# Altium schematic sheet 5Vsupply.SchDoc
size A4; SheetNumber: 2; SheetTotal: 3
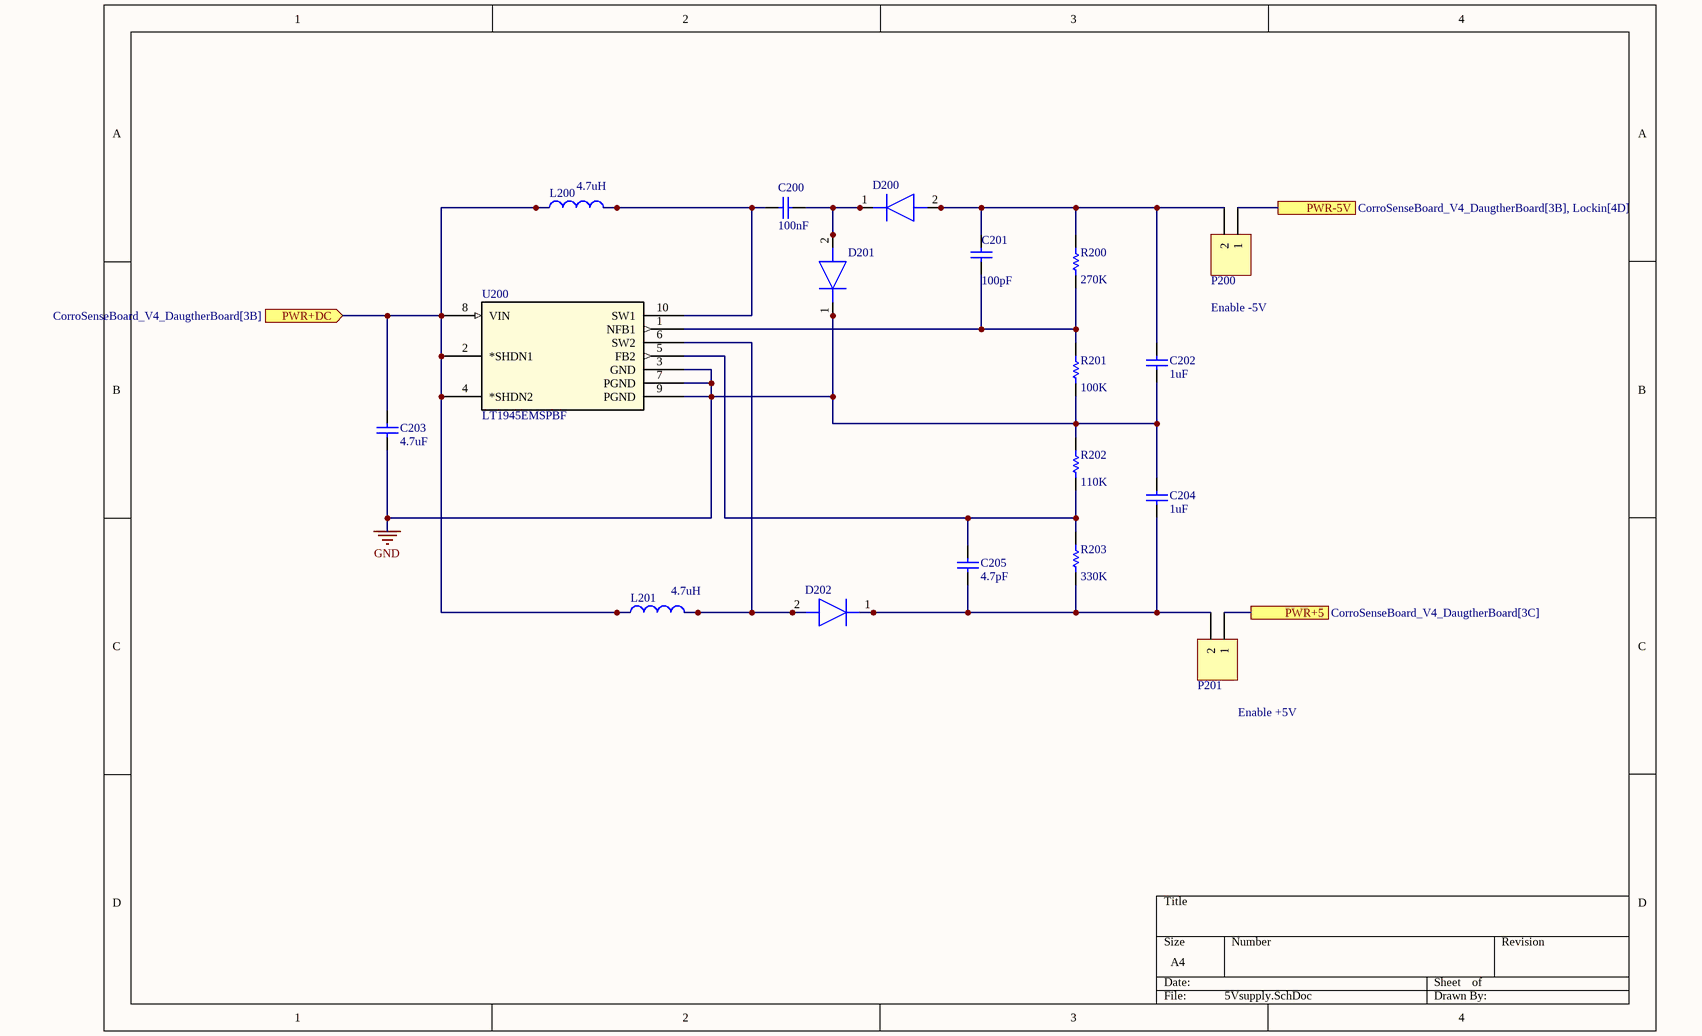
[diagram p0: 5Vsupply.SchDoc]

## Parts
C200  100nF  [1608[0603]]
C201  100pF  [1608[0603]]
C202  1uF  [1608[0603]]
C203  4.7uF  [1608[0603]]
C204  1uF  [1608[0603]]
C205  4.7pF  [1608[0603]]
D200  ZHCS400TA  [SOD2513X120N]  (value not drawn)
D201  ZHCS400TA  [SOD2513X120N]  (value not drawn)
D202  ZHCS400TA  [SOD2513X120N]  (value not drawn)
L200  value 4.7uH  [6-0805_N]  (hidden comment: LQM18PN4R7MFRL)
L201  value 4.7uH  [6-0805_N]  (hidden comment: LQM18PN4R7MFRL)
P200  Header, 2-Pin  [HDR1X2]  (value not drawn)
P201  Header, 2-Pin  [HDR1X2]  (value not drawn)
R200  270K  [1608[0603]]
R201  100K  [1608[0603]]
R202  110K  [1608[0603]]
R203  330K  [1608[0603]]
U200  LT1945EMSPBF  [MSOP-10_MS_LIT]

## Ports
PWR+5 (see CorroSenseBoard_V4_DaugtherBoard[3C]), PWR+DC (in, see CorroSenseBoard_V4_DaugtherBoard[3B]), PWR-5V (see CorroSenseBoard_V4_DaugtherBoard[3B], Lockin[4D])

## Nets
GND: C202.2 C203.2 C204.1 D201.1(K) R201.1 R202.2 U200.3(GND) U200.7(PGND) U200.9(PGND)
PWR+5: P201.1 ; port PWR+5
PWR+DC: C203.1 L200.1 L201.1 U200.2(*SHDN1) U200.4(*SHDN2) U200.8(VIN) ; port PWR+DC
PWR-5V: P200.1 ; port PWR-5V
NetC200_1: C200.1 D200.1(K) D201.2(A)
NetC200_2: C200.2 L200.2 U200.10(SW1)
NetC201_1: C201.1 R200.1 R201.2 U200.1(NFB1)
NetC201_2: C201.2 C202.1 D200.2(A) P200.2 R200.2
NetC204_2: C204.2 C205.2 D202.1(K) P201.2 R203.1
NetC205_1: C205.1 R202.1 R203.2 U200.5(FB2)
NetD202_2: D202.2(A) L201.2 U200.6(SW2)

## Notes on the sheet
- Enable -5V
- Enable +5V

## Library data of the parts
C200 = Cap: CAP CER 25V X7R 0603; Manufacturer: Murata Electronics; MPN: GCJ188R71E104KA12D; Tolerance: ±10%; PackageReference: RAD-0.3; PackageDescription: Radial Cap, Thru-Hole; 2 Leads; 0.3 in Pin Spacing; Value: 100nF; Operating Temperature: -55°C ~ 125°C; Package / Case: 0603 (1608 Metric); Temperature Coefficient: X7R; Voltage - Rated: 25V
C201 = Cap: CAP CER 25V X7R 0603; Manufacturer: KYOCERA AVX; MPN: 06033C101KAT2A; Tolerance: ±10%; PackageReference: RAD-0.3; PackageDescription: Radial Cap, Thru-Hole; 2 Leads; 0.3 in Pin Spacing; Value: 100pF; Operating Temperature: -55°C ~ 125°C; Package / Case: 0603 (1608 Metric); Temperature Coefficient: X7R; Voltage - Rated: 25V
C202 C204 = Cap: CAP CER 25V X7R 0603; Manufacturer: Murata Electronics; MPN: GCM188R71E105KA64D; Tolerance: ±10%; PackageReference: RAD-0.3; PackageDescription: Radial Cap, Thru-Hole; 2 Leads; 0.3 in Pin Spacing; Value: 1uF; Operating Temperature: -55°C ~ 125°C; Package / Case: 0603 (1608 Metric); Temperature Coefficient: X7R; Voltage - Rated: 25V
C203 = Cap: CAP CER 25V X7R 0603; Manufacturer: Murata Electronics; MPN: GRM188R61E475KE11J; Tolerance: ±10%; PackageReference: RAD-0.3; PackageDescription: Radial Cap, Thru-Hole; 2 Leads; 0.3 in Pin Spacing; Value: 4.7uF; Operating Temperature: -55°C ~ 125°C; Package / Case: 0603 (1608 Metric); Temperature Coefficient: X7R; Voltage - Rated: 25V
C205 = Cap: CAP CER 25V X7R 0603; Manufacturer: Murata Electronics; MPN: GRM1885C1H4R7WA01D; Tolerance: ±10%; PackageReference: RAD-0.3; PackageDescription: Radial Cap, Thru-Hole; 2 Leads; 0.3 in Pin Spacing; Value: 4.7pF; Operating Temperature: -55°C ~ 125°C; Package / Case: 0603 (1608 Metric); Temperature Coefficient: X7R; Voltage - Rated: 25V
D200-D202 = ZHCS400TA: Diode; Manufacturer_Name: Diodes Incorporated; Datasheet Link: https://www.diodes.com//assets/Datasheets/ZHCS400.pdf; Height: 1.2mm; Manufacturer_Part_Number: ZHCS400TA; Mouser Part Number: 522-ZHCS400TA; Mouser Price/Stock: https://www.mouser.co.uk/ProductDetail/Diodes-Incorporated/ZHCS400TA?qs=zhx2xqPtQQzuV2hbpdB4gg%3D%3D; Arrow Part Number: ZHCS400TA; Arrow Price/Stock: https://www.arrow.com/en/products/zhcs400ta/diodes-incorporated?region=europe; Manufacturer: Diodes Incorporated; MPN: ZHCS400TA
L200 L201 = Inductor: FIXED IND 4.7UH 620MA 550MOHM SM; Manufacturer: Murata Electronics; Code_IEC: 1005; Published: 8-Jun-2000; LatestRevisionDate: 29-May-2009; LatestRevisionNote: IPC-7351 Footprint Added.; PackageReference: 0402-A; Publisher: Altium Limited; PackageDescription: Chip Inductor; Code_JEITA: 0402; MPN: LQM18PN4R7MFRL
P200 P201 = Header 2: Manufacturer: Wurth Elektronik; MPN: 61300211121; LatestRevisionDate: 17-Jul-2002; LatestRevisionNote: Re-released for DXP Platform.; Publisher: Altium Limited
R200 = Res1: RES SMD 2% 1.5W 0603; Manufacturer: YAGEO; MPN: AC0603FR-07270KL; Published: 8-Jun-2000; LatestRevisionDate: 17-Jul-2002; LatestRevisionNote: Re-released for DXP Platform.; Publisher: Altium Limited; Value: 270K; Code_JEITA: Thick Film; Composition: Thick Film; Operating Temperature: -65°C ~ 155°C; Package: 0603 (1608 Metric); Power (Watts): 1.5W; Tolerance: 2%
R201 = Res1: RES SMD 2% 1.5W 0603; Manufacturer: YAGEO; MPN: RC0603FR-07100KL; Published: 8-Jun-2000; LatestRevisionDate: 17-Jul-2002; LatestRevisionNote: Re-released for DXP Platform.; Publisher: Altium Limited; Value: 100K; Code_JEITA: Thick Film; Composition: Thick Film; Operating Temperature: -65°C ~ 155°C; Package: 0603 (1608 Metric); Power (Watts): 1.5W; Tolerance: 2%
R202 = Res1: RES SMD 2% 1.5W 0603; Manufacturer: YAGEO; MPN: AC0603FR-10110KL; Published: 8-Jun-2000; LatestRevisionDate: 17-Jul-2002; LatestRevisionNote: Re-released for DXP Platform.; Publisher: Altium Limited; Value: 110K; Code_JEITA: Thick Film; Composition: Thick Film; Operating Temperature: -65°C ~ 155°C; Package: 0603 (1608 Metric); Power (Watts): 1.5W; Tolerance: 2%
R203 = Res1: RES SMD 2% 1.5W 0603; Manufacturer: YAGEO; MPN: AC0603FR-07330KL; Published: 8-Jun-2000; LatestRevisionDate: 17-Jul-2002; LatestRevisionNote: Re-released for DXP Platform.; Publisher: Altium Limited; Value: 330K; Code_JEITA: Thick Film; Composition: Thick Film; Operating Temperature: -65°C ~ 155°C; Package: 0603 (1608 Metric); Power (Watts): 1.5W; Tolerance: 2%
U200 = LT1945EMSPBF: No Description Available; Mfr_Name: Analog Devices Inc; RefDes: RefDes; Type: Type; Manufacturer: Analog Devices Inc; MPN: LT1945EMSPBF